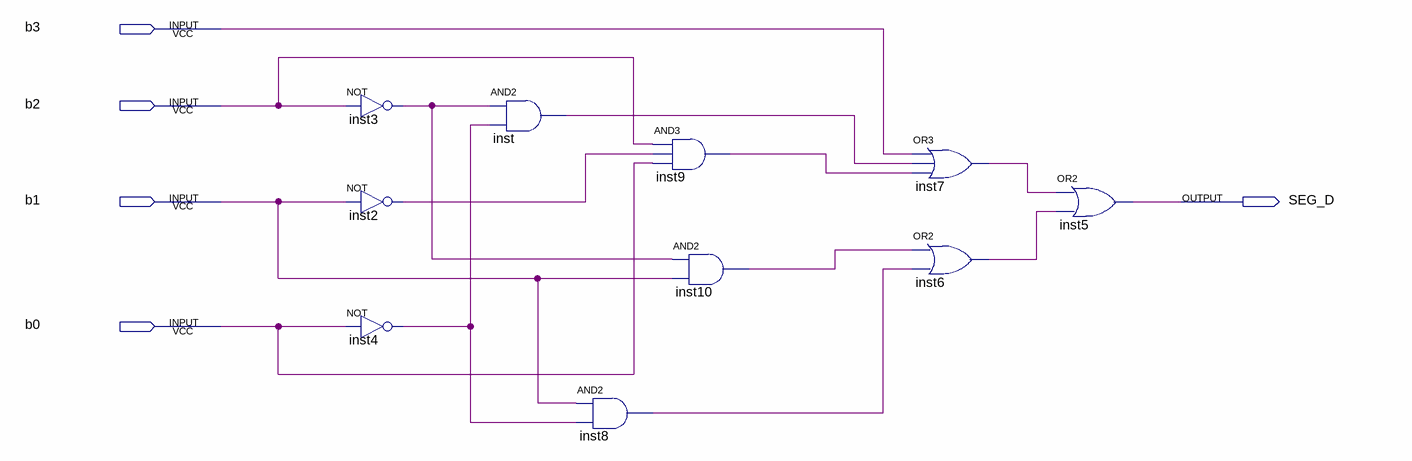
[diagram p0: schematic sheet]
// Quartus schematic BCD_7SEG_D.bdf as structural Verilog: 10 symbols, 5 pins
module BCD_7SEG_D (
  input  b3,
  input  b2,
  input  b1,
  input  b0,
  output SEG_D
);

  wire inst2_out, inst3_out, inst4_out, inst6_out, inst7_out, inst8_out, inst9_out, inst10_out, inst_out;

  not inst3 (inst3_out, b2);
  not inst2 (inst2_out, b1);
  not inst4 (inst4_out, b0);
  and inst (inst_out, inst3_out, inst4_out);
  and inst8 (inst8_out, b1, inst4_out);
  and inst9 (inst9_out, b2, inst2_out, b0);
  and inst10 (inst10_out, inst3_out, b1);
  or inst7 (inst7_out, b3, inst_out, inst9_out);
  or inst6 (inst6_out, inst10_out, inst8_out);
  or inst5 (SEG_D, inst7_out, inst6_out);
endmodule
